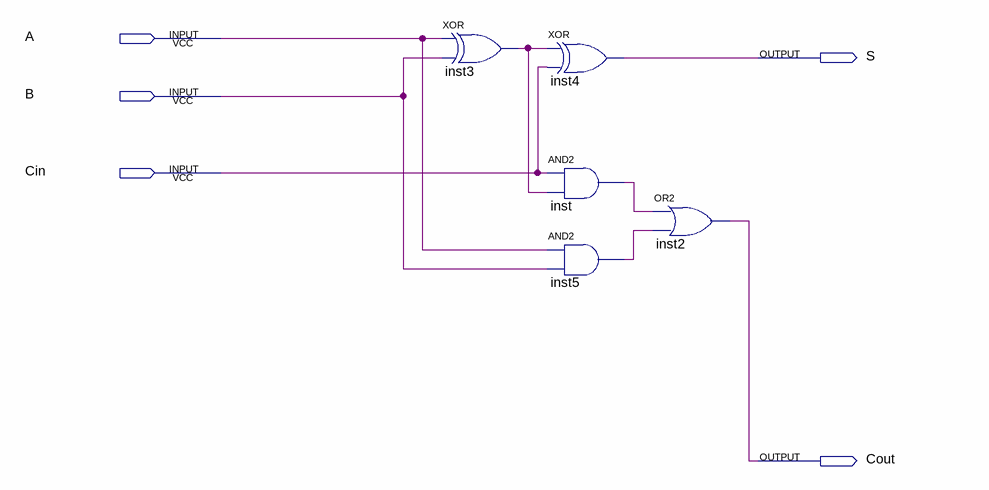
[diagram p0: schematic sheet]
// Quartus schematic Adder.bdf as structural Verilog: 5 symbols, 5 pins
module Adder (
  input  A,
  input  B,
  input  Cin,
  output S,
  output Cout
);

  wire inst3_out, inst5_out, inst_out;

  xor inst3 (inst3_out, A, B);
  xor inst4 (S, inst3_out, Cin);
  and inst (inst_out, Cin, inst3_out);
  and inst5 (inst5_out, A, B);
  or inst2 (Cout, inst_out, inst5_out);
endmodule
